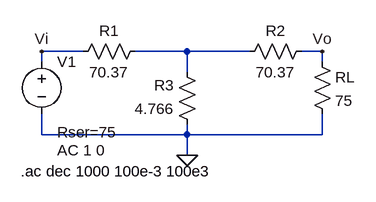
[diagram p0: schematic 1.asc]
1.asc, the LTspice schematic file:
Version 4
SHEET 1 880 680
WIRE 48 144 -16 144
WIRE 208 144 128 144
WIRE 304 144 208 144
WIRE 416 144 384 144
WIRE -16 160 -16 144
WIRE 416 160 416 144
WIRE 208 176 208 144
WIRE -16 272 -16 240
WIRE 208 272 208 256
WIRE 208 272 -16 272
WIRE 416 272 416 240
WIRE 416 272 208 272
WIRE 208 304 208 272
FLAG 208 304 0
FLAG 416 144 Vo
FLAG -16 144 Vi
SYMBOL res 144 128 R90
WINDOW 0 0 56 VBottom 2
WINDOW 3 32 56 VTop 2
SYMATTR InstName R1
SYMATTR Value 70.37
SYMBOL res 400 128 R90
WINDOW 0 0 56 VBottom 2
WINDOW 3 32 56 VTop 2
SYMATTR InstName R2
SYMATTR Value 70.37
SYMBOL res 224 272 R180
WINDOW 0 36 76 Left 2
WINDOW 3 36 40 Left 2
SYMATTR InstName R3
SYMATTR Value 4.766
SYMBOL voltage -16 144 R0
WINDOW 123 24 152 Left 2
WINDOW 39 24 124 Left 2
SYMATTR Value2 AC 1 0
SYMATTR SpiceLine Rser=75
SYMATTR InstName V1
SYMATTR Value ""
SYMBOL res 400 144 R0
SYMATTR InstName RL
SYMATTR Value 75
TEXT -48 328 Left 2 !.ac dec 1000 100e-3 100e3

The netlist it stands for:
* 1.asc
R1 N001 Vi 70.37
R2 Vo N001 70.37
R3 0 N001 4.766
V1 Vi 0 AC 1 0 Rser=75
RL Vo 0 75
.ac dec 1000 100e-3 100e3
.backanno
.end